# EAGLE schematic etchsy.pdf (EAGLE 9.6.2)
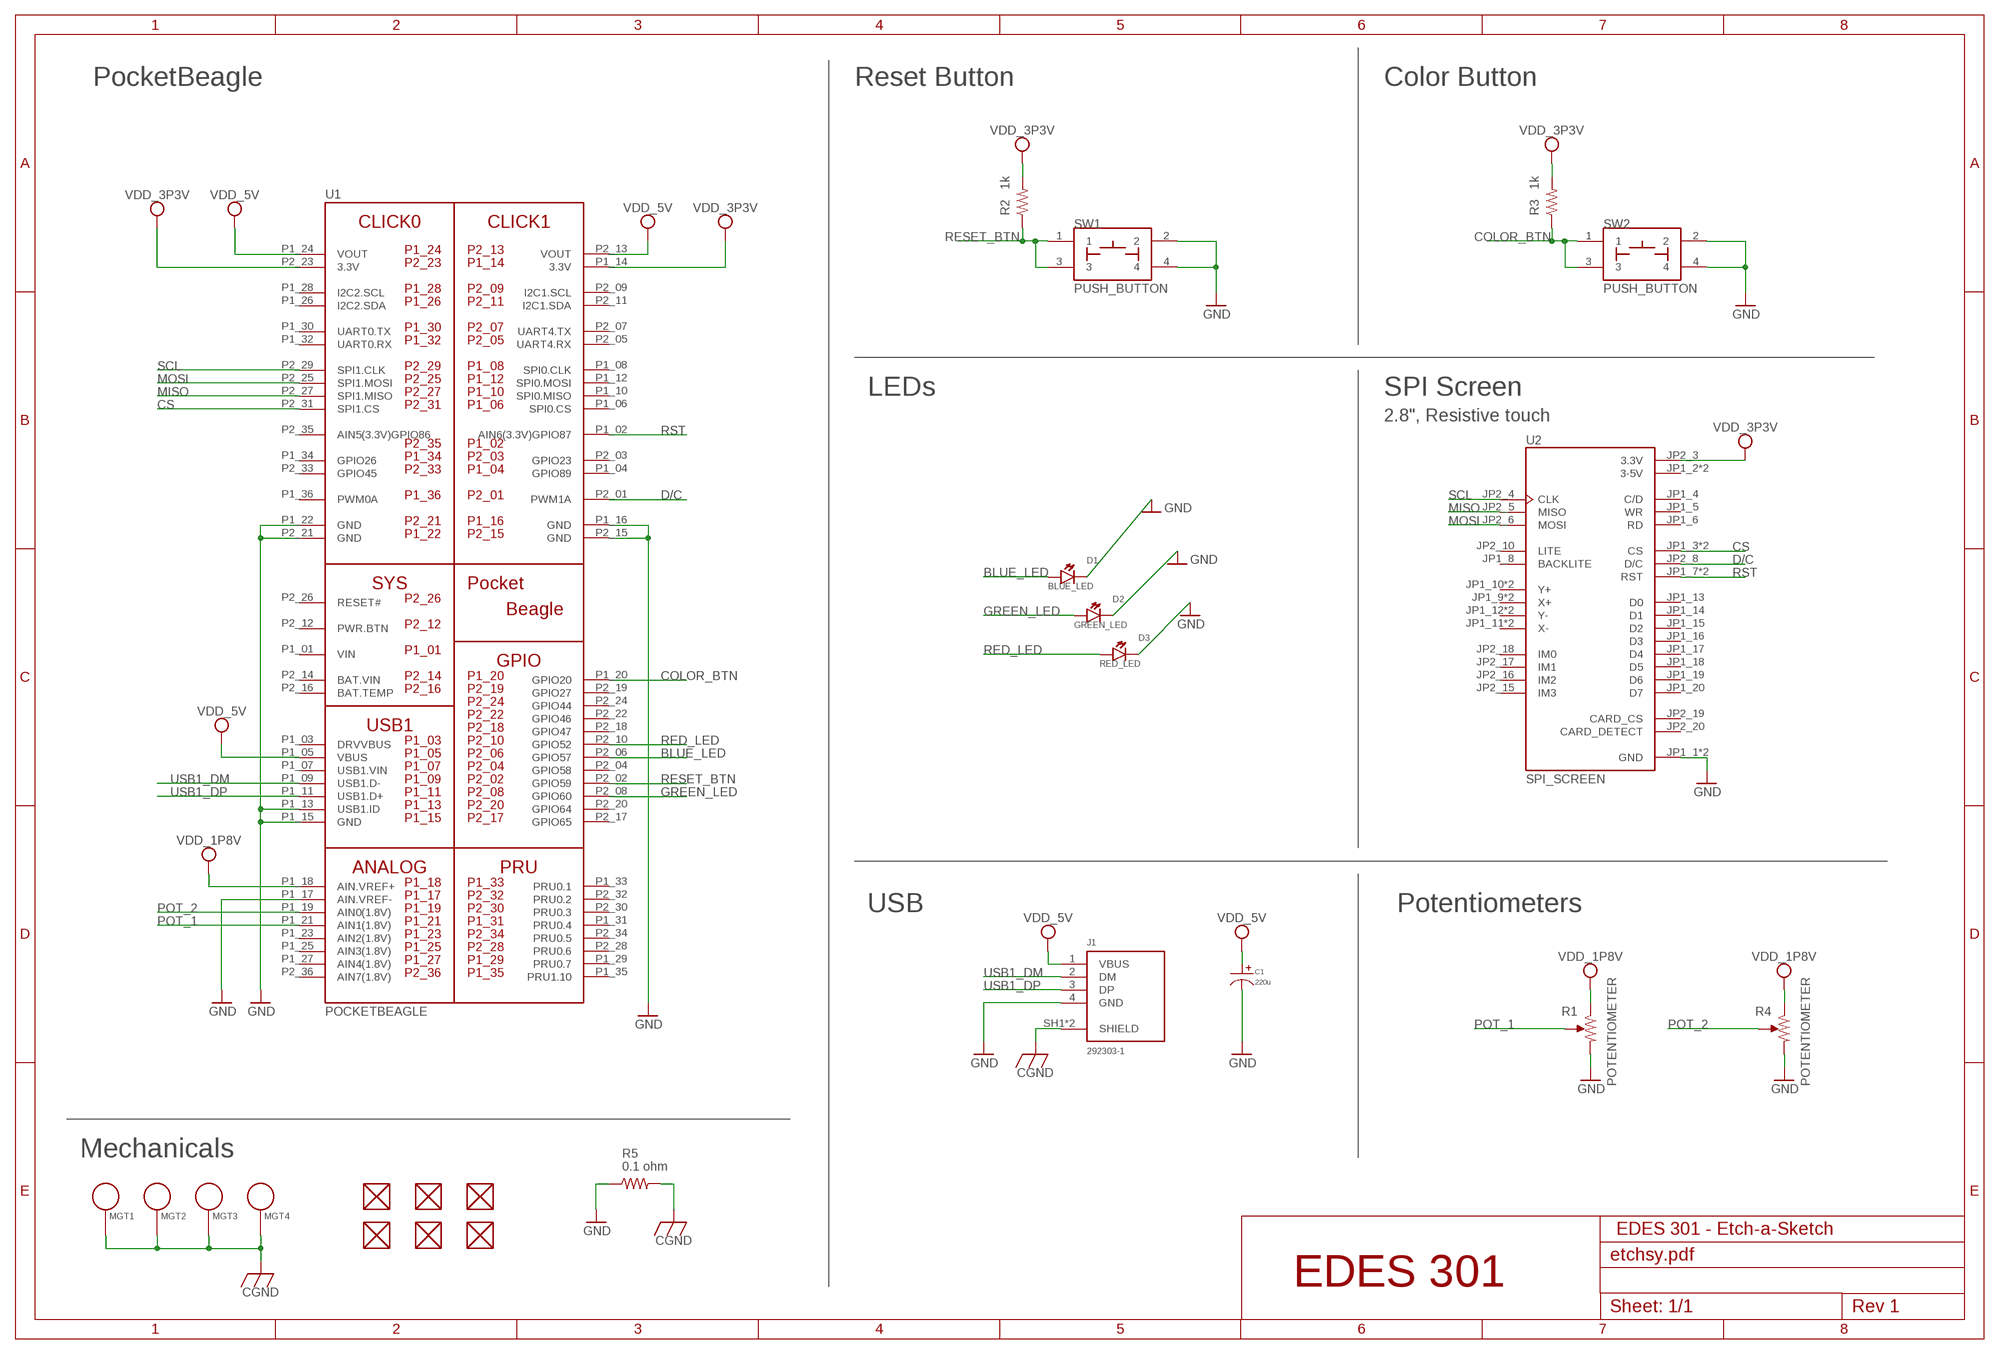
[diagram p0: schematic, sheet 1]

## Parts
C1  220u  CAPACITOR_P_10MM  [CP10MM]
D1  BLUE_LED  LED  [EIA-STD]
D2  GREEN_LED  LED  [EIA-STD]
D3  RED_LED  LED  [EIA-STD]
FUD1  FIDUCIAL  [FIDUCIAL_40MIL]
FUD2  FIDUCIAL  [FIDUCIAL_40MIL]
FUD3  FIDUCIAL  [FIDUCIAL_40MIL]
FUD4  FIDUCIAL  [FIDUCIAL_40MIL]
FUD5  FIDUCIAL  [FIDUCIAL_40MIL]
FUD6  FIDUCIAL  [FIDUCIAL_40MIL]
J1  292303-1  [TE_292303-1]
MGT1  MOUNTING_HOLE  [MOUNTING_HOLE]
MGT2  MOUNTING_HOLE  [MOUNTING_HOLE]
MGT3  MOUNTING_HOLE  [MOUNTING_HOLE]
MGT4  MOUNTING_HOLE  [MOUNTING_HOLE]
R1  POTENTIOMETER  [POT-PO90S]
R2  1k  R_R0603  [R0603]
R3  1k  R_R0603  [R0603]
R4  POTENTIOMETER  [POT-PO90S]
R5  0.1 ohm  R_R0805  [R0805]
SW1  PUSH_BUTTON  [BUTTON_12.5MM]
SW2  PUSH_BUTTON  [BUTTON_12.5MM]
U1  POCKETBEAGLE  [POCKETBEAGLE]
U2  SPI_SCREEN  [MODULE_1770]

## Nets
BLUE_LED: D1.ANODE U1.P2_06(GPIO57)
CGND: J1.SH1(SHIELD) J1.SH2(SHIELD) MGT1.P$1 MGT2.P$1 MGT3.P$1 MGT4.P$1 R5.2
COLOR_BTN: R3.1 SW2.1 SW2.3 U1.P1_20(GPIO20)
CS: U1.P2_31(SPI1.CS) U2.JP1_3(CS) U2.JP2_7(CS)
D/C: U1.P2_01(PWM1A) U2.JP2_8(D/C)
GND: C1.P$2 D1.CATHODE D2.CATHODE D3.CATHODE J1.4(GND) R1.CW R4.CW R5.1 SW1.2 SW1.4 SW2.2 SW2.4 U1.P1_13(USB1.ID) U1.P1_15(GND) U1.P1_16(GND) U1.P1_17(AIN.VREF-) U1.P1_22(GND) U1.P2_15(GND) U1.P2_21(GND) U2.JP1_1(GND) U2.JP2_1(GND)
GREEN_LED: D2.ANODE U1.P2_08(GPIO60)
MISO: U1.P2_27(SPI1.MISO) U2.JP2_5(MISO)
MOSI: U1.P2_25(SPI1.MOSI) U2.JP2_6(MOSI)
POT_1: R1.S U1.P1_21(AIN1(1.8V))
POT_2: R4.S U1.P1_19(AIN0(1.8V))
RED_LED: D3.ANODE U1.P2_10(GPIO52)
RESET_BTN: R2.1 SW1.1 SW1.3 U1.P2_02(GPIO59)
RST: U1.P1_02(AIN6(3.3V)GPIO87) U2.JP1_7(RST) U2.JP2_9(RST)
SCL: U1.P2_29(SPI1.CLK) U2.JP2_4(CLK)
USB1_DM: J1.2(DM) U1.P1_09(USB1.D-)
USB1_DP: J1.3(DP) U1.P1_11(USB1.D+)
VDD_1P8V: R1.CCW R4.CCW U1.P1_18(AIN.VREF+)
VDD_3P3V: R2.2 R3.2 U1.P1_14(3.3V) U1.P2_23(3.3V) U2.JP2_3(3.3V)
VDD_5V: C1.P$1 J1.1(VBUS) U1.P1_05(VBUS) U1.P1_24(VOUT) U1.P2_13(VOUT)
Unconnected: FUD1.P$1 FUD2.P$1 FUD3.P$1 FUD4.P$1 FUD5.P$1 FUD6.P$1 U1.P1_03(DRVVBUS) U1.P1_04(GPIO89) U1.P1_06(SPI0.CS) U1.P1_07(USB1.VIN) U1.P1_08(SPI0.CLK) U1.P1_10(SPI0.MISO) U1.P1_12(SPI0.MOSI) U1.P1_23(AIN2(1.8V)) U1.P1_25(AIN3(1.8V)) U1.P1_26(I2C2.SDA) U1.P1_27(AIN4(1.8V)) U1.P1_28(I2C2.SCL) U1.P1_29(PRU0.7) U1.P1_30(UART0.TX) U1.P1_31(PRU0.4) U1.P1_32(UART0.RX) U1.P1_33(PRU0.1) U1.P1_34(GPIO26) U1.P1_35(PRU1.10) U1.P1_36(PWM0A) U1.P2_03(GPIO23) U1.P2_04(GPIO58) U1.P2_05(UART4.RX) U1.P2_07(UART4.TX) U1.P2_09(I2C1.SCL) U1.P2_11(I2C1.SDA) U1.P2_12(PWR.BTN) U1.P2_16(BAT.TEMP) U1.P2_17(GPIO65) U1.P2_18(GPIO47) U1.P2_19(GPIO27) U1.P2_20(GPIO64) U1.P2_22(GPIO46) U1.P2_24(GPIO44) U1.P2_26(RESET#) U1.P2_28(PRU0.6) U1.P2_30(PRU0.3) U1.P2_32(PRU0.2) U1.P2_33(GPIO45) U1.P2_34(PRU0.5) U1.P2_35(AIN5(3.3V)GPIO86) U1.P2_36(AIN7(1.8V)) U2.JP1_4(C/D) U2.JP1_5(WR) U2.JP1_6(RD) U2.JP1_8(BACKLITE) U2.JP1_9(X+) U2.JP1_10(Y+) U2.JP1_11(X-) U2.JP1_12(Y-) U2.JP1_13(D0) U2.JP1_14(D1) U2.JP1_15(D2) U2.JP1_16(D3) U2.JP1_17(D4) U2.JP1_18(D5) U2.JP1_19(D6) U2.JP1_20(D7) U2.JP2_10(LITE) U2.JP2_11(Y+) U2.JP2_12(X+) U2.JP2_13(Y-) U2.JP2_14(X-) U2.JP2_15(IM3) U2.JP2_16(IM2) U2.JP2_17(IM1) U2.JP2_18(IM0) U2.JP2_19(CARD_CS) U2.JP2_20(CARD_DETECT)

## Notes on the sheet
- PocketBeagle | Reset Button | Color Button
- LEDs | SPI Screen
- 2.8", Resistive touch
- USB | Potentiometers
- Mechanicals
- EDES 301 - Etch-a-Sketch
- EDES 301
- 1/1

## Power pins joined to a net without a drawn wire
3-5V: U2.JP1_2(3-5V) U2.JP2_2(3-5V)
BAT.VIN: U1.P2_14(BAT.VIN)
VIN: U1.P1_01(VIN)

## Library data of the parts
C1 = etchasketch:CAPACITOR_P: Library: MF_Passives Description: Device for Polarized Capacitors. Manufacture part number (MPN), Voltage Rating, and Tolerance can be added via Attributes. Check https://factory.macrofab.com/parts for the house parts list.; POPULATE: 1
D1-D3 = etchasketch:LED: EIA-STD LED, LTST-C191TBKT
FUD1-FUD6 = combo_lock:FIDUCIAL
J1 = etchasketch:292303-1: Check availability <https://pricing.snapeda.com/parts/292303-1/TE%20Connectivity/view-part?ref=eda>; AVAILABILITY: In Stock; CENTERLINE_PITCH: 2 mm[.078 in]; CHECK_PRICES: https://www.snapeda.com/parts/292303-1/TE+Connectivity+AMP+Connectors/view-part/?ref=eda; COMMENT: 292303-1; DESCRIPTION: Type A Standard USB Connector 4 Position Right Angle Mount 1 Port | TE Connectivity 292303-1; EU_ROHS_COMPLIANCE: Compliant; MF: TE Connectivity; MP: 292303-1; NUMBER_OF_POSITIONS: 4; PACKAGE: None; PRICE: None; PRODUCT_TYPE: Connector; SNAPEDA_LINK: https://www.snapeda.com/parts/292303-1/TE+Connectivity+AMP+Connectors/view-part/?ref=snap
MGT1-MGT4 = combo_lock:MOUNTING_HOLE: Chassis Mounting Hole w/GND connection ability
R1 R4 = etchasketch:POTENTIOMETER: Potentiometer - Examples: P090S-14T20BR10K (987-1277-ND)
R2 R3 = etchasketch:R_: RESISTOR, American symbol. 1k
R5 = combo_lock:R_: RESISTOR, American symbol
SW1 SW2 = etchasketch:PUSH_BUTTON
U1 = etchasketch:POCKETBEAGLE
U2 = etchasketch:SPI_SCREEN: Check availability <https://pricing.snapeda.com/parts/1770/Adafruit%20Industries/view-part?ref=eda>; AVAILABILITY: In Stock; CHECK_PRICES: https://www.snapeda.com/parts/1770/Adafruit+Industries/view-part/?ref=eda; DESCRIPTION: 2.8 TFT LCD with Touchscreen Breakout Board w/MicroSD Socket | Adafruit Industries 1770; MF: Adafruit Industries; MP: 1770; PACKAGE: None; PRICE: None; SNAPEDA_LINK: https://www.snapeda.com/parts/1770/Adafruit+Industries/view-part/?ref=snap